# EAGLE design ISE2024_14thboard#1.1 (EAGLE 9.6.2)
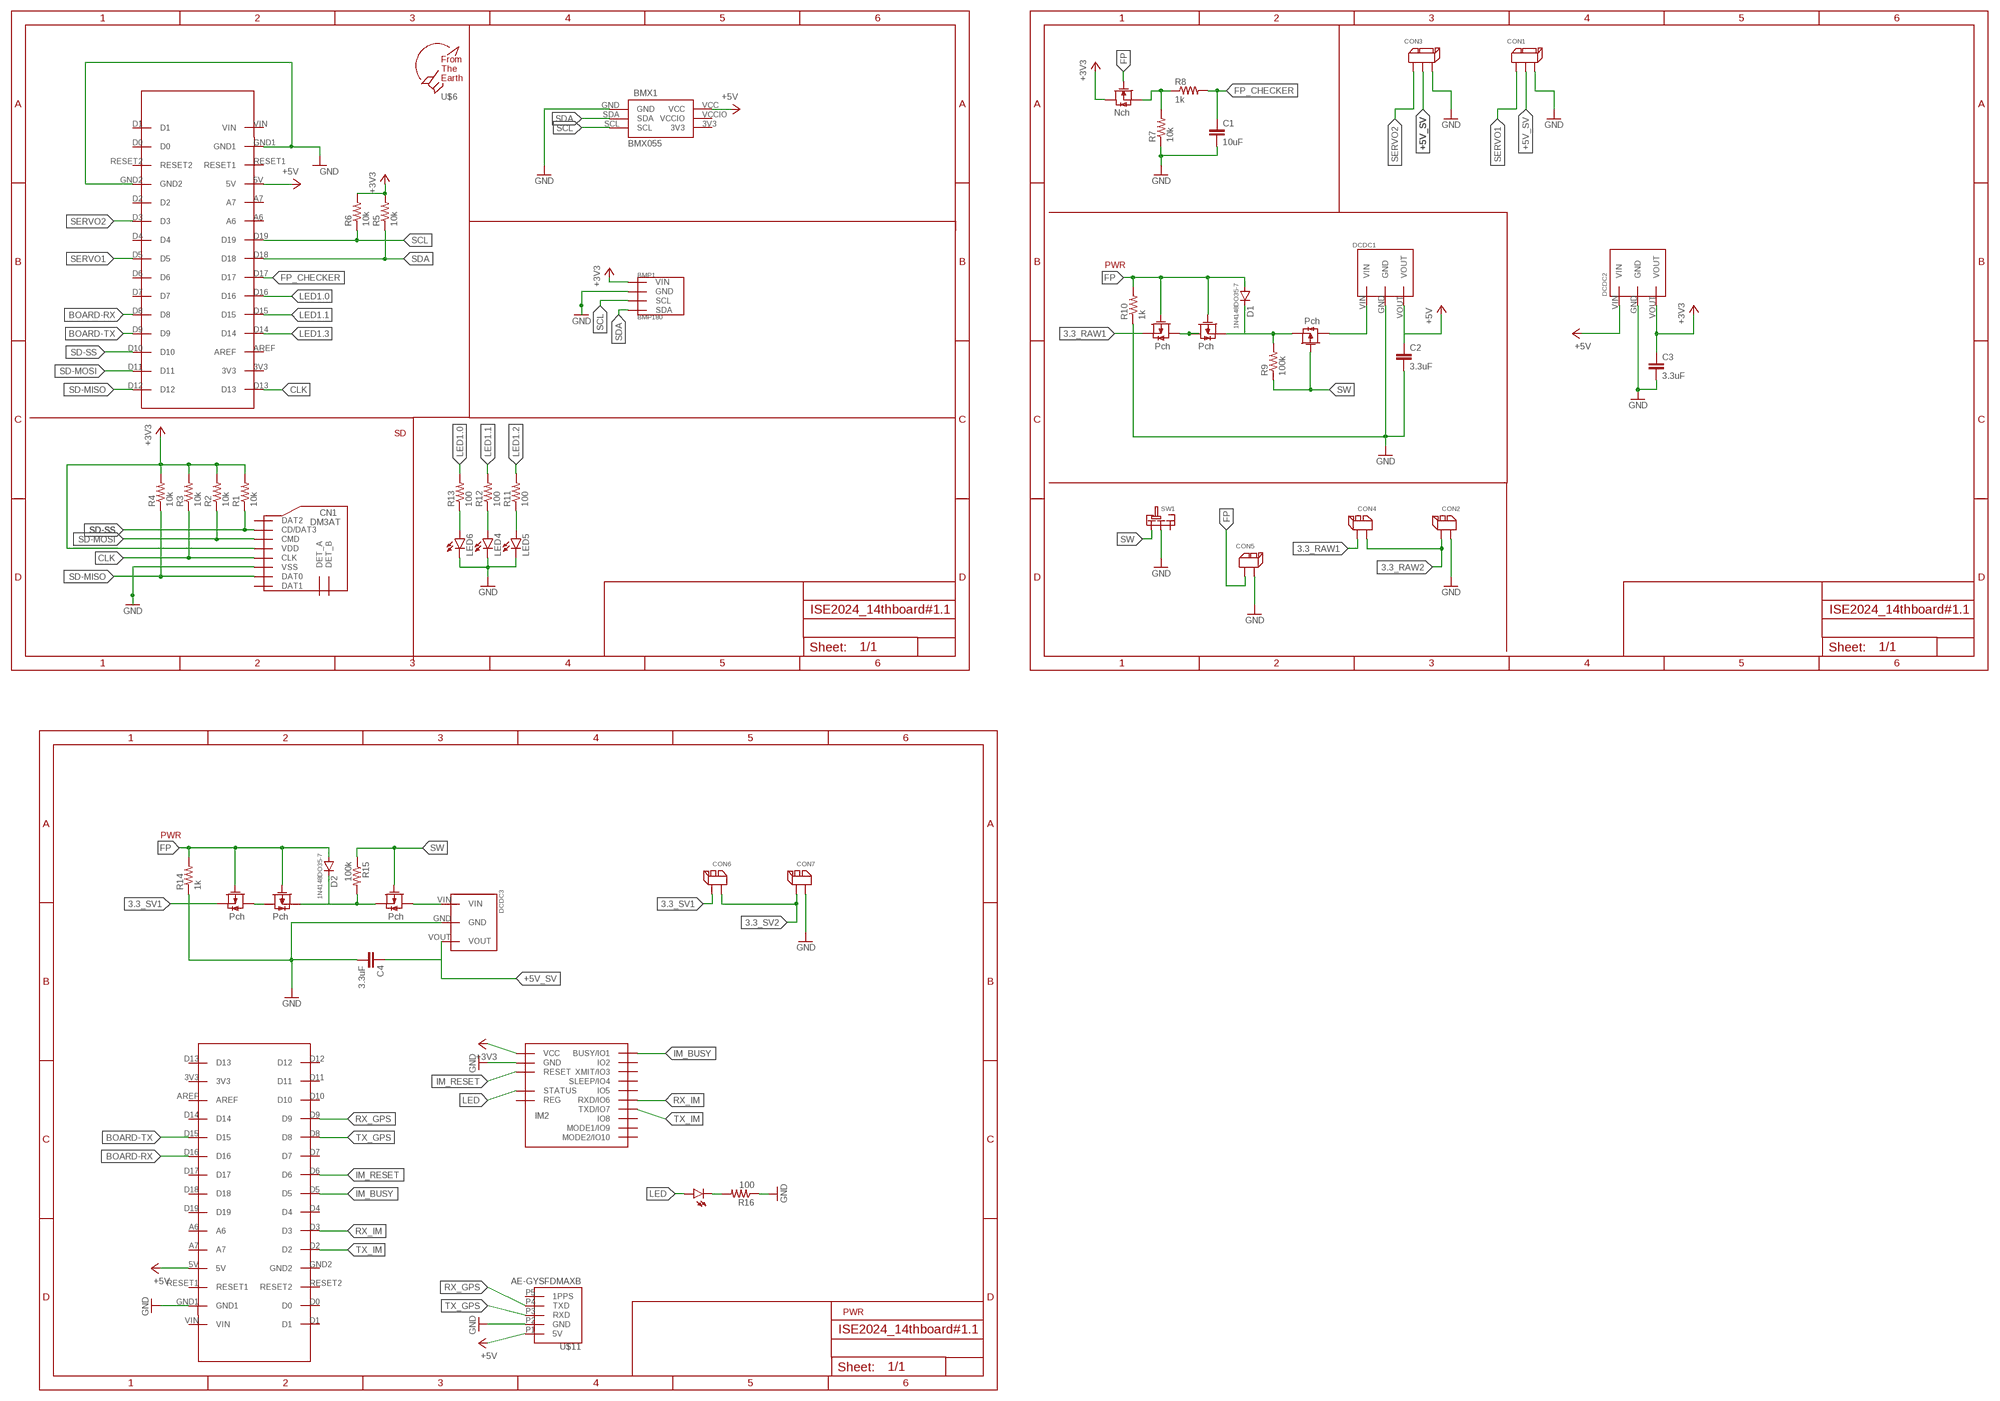
[diagram p0: schematic, sheet 1]

## Parts
BMP1  BMP180  [GY-68]
BMX1  BMX055  [BMX055]
C1  10uF  C-EU025-024X044  [C025-024X044]
C2  3.3uF  C-EU025-024X044  [C025-024X044]
C3  3.3uF  C-EU025-024X044  [C025-024X044]
C4  3.3uF  C-EU025-024X044  [C025-024X044]
CN1  DM3AT  [DM3AT]
CON1  3PIN  [3PIN]
CON2  2PIN  [2PIN]
CON3  3PIN  [3PIN]
CON4  2PIN  [2PIN]
CON5  2PIN  [2PIN]
CON6  2PIN  [2PIN]
CON7  2PIN  [2PIN]
D1  1N4148DO35-7  [DO35-7]
D2  1N4148DO35-7  [DO35-7]
DCDC1  5V1A_M78AR05-1  [5V1A_M78AR05-1]
DCDC2  3.3V1A_M78AR033-1  [3.3V1A_M78AR033-1]
DCDC3  5V1A_M78AR05-1  [5V1A_M78AR05-1]
IM2  IM920_IM920C  [IM920_IM920C]
LED1  LED5MM  [LED5MM]
LED4  LED5MM  [LED5MM]
LED5  LED5MM  [LED5MM]
LED6  LED5MM  [LED5MM]
R1  10k  R-US_0204/7  [0204/7]
R2  10k  R-US_0204/7  [0204/7]
R3  10k  R-US_0204/7  [0204/7]
R4  10k  R-US_0204/7  [0204/7]
R5  10k  R-US_0204/7  [0204/7]
R6  10k  R-US_0204/7  [0204/7]
R7  10k  R-US_0204/7  [0204/7]
R8  1k  R-US_0204/7  [0204/7]
R9  100k  R-US_0204/7  [0204/7]
R10  1k  R-US_0204/7  [0204/7]
R11  100  R-US_0204/7  [0204/7]
R12  100  R-US_0204/7  [0204/7]
R13  100  R-US_0204/7  [0204/7]
R14  1k  R-US_0204/7  [0204/7]
R15  100k  R-US_0204/7  [0204/7]
R16  100  R-US_0204/7  [0204/7]
SW1  SRIDE_SWITCH  [SRIDE_SWITCH]
U$1  ARDUINONANO  [ARDUINONANO]
U$2  2SJ681-PCH  [2SJ681]
U$3  2SK4017-NCH  [2SK4017]
U$4  2SJ681-PCH  [2SJ681]
U$5  2SJ681-PCH  [2SJ681]
U$6  F.T.E.LOGO  [LOGO]
U$7  ARDUINONANO  [ARDUINONANO]
U$8  2SJ681-PCH  [2SJ681]
U$9  2SJ681-PCH  [2SJ681]
U$10  2SJ681-PCH  [2SJ681]
U$11  AE-GYSFDMAXB  [AE-GYSFDMAXB]

## Nets
3.3_RAW1: CON4.P$2 U$2.SOURCE
3.3_RAW2: CON2.P$2 CON4.P$1
3.3_SV1: CON6.P$2 U$8.SOURCE
3.3_SV2: CON6.P$1 CON7.P$2
+3V3: BMP1.P1(VIN) C3.1 CN1.VDD DCDC2.VOUT IM2.$P17(VCC) R1.2 R2.2 R3.2 R4.2 R5.2 R6.2 U$3.DRAIN
+5V: BMX1.VCC C2.1 DCDC1.VOUT DCDC2.VIN U$1.5V U$7.5V
+5V1: DCDC1.VIN U$5.DRAIN
+5V2: DCDC3.VIN U$9.DRAIN
+5V_SV: C4.1 CON1.P$2 CON3.P$2 DCDC3.VOUT
BOARD-RX: U$1.D8 U$7.D16
BOARD-TX: U$1.D9 U$7.D15
CLK: CN1.CLK R3.1 U$1.D13
FP: CON5.P$1 D1.A D2.A R10.2 R14.2 U$2.GATE U$3.GATE U$4.GATE U$8.GATE U$10.GATE
FP_CHECKER: C1.1 R8.2 U$1.D17
GND: BMP1.P2(GND) BMX1.GND C1.2 C2.2 C3.2 C4.2 CN1.VSS CON1.P$3 CON2.P$1 CON3.P$3 CON5.P$2 CON7.P$1 DCDC1.GND DCDC2.GND DCDC3.GND IM2.$P18(GND) LED4.K(C) LED5.K(C) LED6.K(C) R7.1 R10.1 R14.1 R16.1 SW1.LR U$1.GND1 U$1.GND2 U$7.GND1 U$11.P2(GND)
IM_BUSY: IM2.$P1(BUSY/IO1) U$7.D5
IM_RESET: IM2.$P19(RESET) U$7.D6
LED: IM2.$P15(STATUS) LED1.A
LED1.0: R13.2 U$1.D16
LED1.1: R12.2 U$1.D15
LED1.2: R11.2
LED1.3: U$1.D14
N$1: U$2.DRAIN U$4.DRAIN
N$2: LED6.A R13.1
N$3: D1.C R9.2 U$4.SOURCE U$5.SOURCE
N$4: D2.C R15.2 U$9.SOURCE U$10.SOURCE
N$5: U$8.DRAIN U$10.DRAIN
N$6: U$11.P1(5V) ; supply symbol labelled +5V
N$7: LED4.A R12.1
N$8: LED1.K(C) R16.2
N$9: LED5.A R11.1
N$14: R7.2 R8.1 U$3.SOURCE
RX_GPS: U$7.D9 U$11.P4(TXD)
RX_IM: IM2.$P6(RXD/IO6) U$7.D3
SCL: BMP1.P3(SCL) BMX1.SCL R6.1 U$1.D19
SD-MISO: CN1.DAT0 R4.1 U$1.D12
SD-MOSI: CN1.CMD R2.1 U$1.D11
SD-SS: CN1.CD/DAT3 R1.1 U$1.D10
SDA: BMP1.P4(SDA) BMX1.SDA R5.1 U$1.D18
SERVO1: CON1.P$1 U$1.D5
SERVO2: CON3.P$1 U$1.D3
SW: R9.1 R15.1 SW1.L U$5.GATE U$9.GATE
TX_GPS: U$7.D8 U$11.P3(RXD)
TX_IM: IM2.$P7(TXD/IO7) U$7.D2
Unconnected: CN1.DAT1 CN1.DAT2 CN1.DET_A CN1.DET_B IM2.$P2(IO2) IM2.$P3(XMIT/IO3) IM2.$P4(SLEEP/IO4) IM2.$P5(IO5) IM2.$P8(IO8) IM2.$P9(MODE1/IO9) IM2.$P10(MODE2/IO10) IM2.$P16(REG) SW1.R U$1.3V3 U$1.A6 U$1.A7 U$1.AREF U$1.D0 U$1.D1 U$1.D2 U$1.D4 U$1.D6 U$1.D7 U$1.RESET1 U$1.RESET2 U$1.VIN U$7.3V3 U$7.A6 U$7.A7 U$7.AREF U$7.D0 U$7.D1 U$7.D4 U$7.D7 U$7.D10 U$7.D11 U$7.D12 U$7.D13 U$7.D14 U$7.D17 U$7.D18 U$7.D19 U$7.GND2 U$7.RESET1 U$7.RESET2 U$7.VIN U$11.P5(1PPS)

## Notes on the sheet
- PWR
- SD
- PWR
- PWR

## Power pins joined to a net without a drawn wire
3V3: BMX1.3V3
VCCIO: BMX1.VCCIO

## Library data of the parts
BMP1 = BMP180:BMP180
BMX1 = BMX055:BMX055
C1-C4 = rcl:C-EU: CAPACITOR, European symbol; SPICEPREFIX: C
CN1 = microSD:DM3AT
CON1 CON3 = XR Connector:3PIN
CON2 CON4-CON7 = XR Connector:2PIN
D1 D2 = diode:1N4148: DIODE high speed (Philips)
DCDC1 DCDC3 = DC-DC:5V1A_M78AR05-1
DCDC2 = DC-DC:3.3V1A_M78AR033-1
IM2 = CANSAT12th:IM920_IM920C
LED1 LED4-LED6 = led:LED: LED OSRAM: - CHIPLED LG R971, LG N971, LY N971, LG Q971, LY Q971, LO R971, LY R971 LH N974, LH R974 LS Q976, LO Q976, LY Q976 LO Q996 - Hyper CHIPLED LW Q18S LB Q993, LB Q99A, LB R99A - SideLED LS A670, LO A670, LY A670, LG A670, LP A670 LB A673, LV A673, LT A673, LW A673 LH A674 LY A675 LS A676, LA A676, LO A676, LY A676, LW A676 LS A679, LY A679, LG A679 - Hyper Micro SIDELED® LS Y876, LA Y876, LO Y876, LY Y876 LT Y87S - SmartLED LW L88C, LW L88S LB L89C, LB L89S, LG L890 LS L89K, LO L89K, LY L89K LS L896, LA L896, LO L896, LY L896 - TOPLED LS T670, LO T670, LY T670, LG T670, LP T670 LSG T670, LSP T670, LSY T670, LOP T670, LYG T670 LG T671, LOG T671, LSG T671 LB T673, LV T673, LT T673, LW T673 LH T674 LS T676, LA T676, LO T676, LY T676, LB T676, LH T676, LSB T676, LW T676 LB T67C, LV T67C, LT T67C, LS T67K, LO T67K, LY T67K, LW E67C LS E67B, LA E67B, LO E67B, LY E67B, LB E67C, LV E67C, LT E67C LW T67C LS T679, LY T679, LG T679 LS T770, LO T770, LY T770, LG T770, LP T770 LB T773, LV T773, LT T773, LW T773 LH T774 LS E675, LA E675, LY E675, LS T675 LS T776, LA T776, LO T776, LY T776, LB T776 LHGB T686 LT T68C, LB T68C - Hyper Mini TOPLED® LB M676 - Mini TOPLED Santana® LG M470 LS M47K, LO M47K, LY M47K Source: http://www.osram.convergy.de LUXEON: - LUMILED® LXK2-PW12-R00, LXK2-PW12-S00, LXK2-PW14-U00, LXK2-PW14-V00 LXK2-PM12-R00, LXK2-PM12-S00, LXK2-PM14-U00 LXK2-PE12-Q00, LXK2-PE12-R00, LXK2-PE12-S00, LXK2-PE14-T00, LXK2-PE14-U00 LXK2-PB12-K00, LXK2-PB12-L00, LXK2-PB12-M00, LXK2-PB14-N00, LXK2-PB14-P00, LXK2-PB14-Q00 LXK2-PR12-L00, LXK2-PR12-M00, LXK2-PR14-Q00, LXK2-PR14-R00 LXK2-PD12-Q00, LXK2-PD12-R00, LXK2-PD12-S00 LXK2-PH12-R00, LXK2-PH12-S00 LXK2-PL12-P00, LXK2-PL12-Q00, LXK2-PL12-R00 Source: www.luxeon.com KINGBRIGHT: KA-3528ASYC Source: www.kingbright.com
R1-R16 = rcl:R-US_: RESISTOR, American symbol; SPICEPREFIX: R
SW1 = Sride Switch:SRIDE_SWITCH
U$1 U$7 = arduinonano device:ARDUINONANO
U$2 U$4 U$5 U$8-U$10 = mosfet:2SJ681-PCH
U$3 = mosfet:2SK4017-NCH
U$6 = logo:F.T.E.LOGO
U$11 = AE-GYSFDMAXB:AE-GYSFDMAXB

## Net classes
0 default: width 0.406 mm

## Board
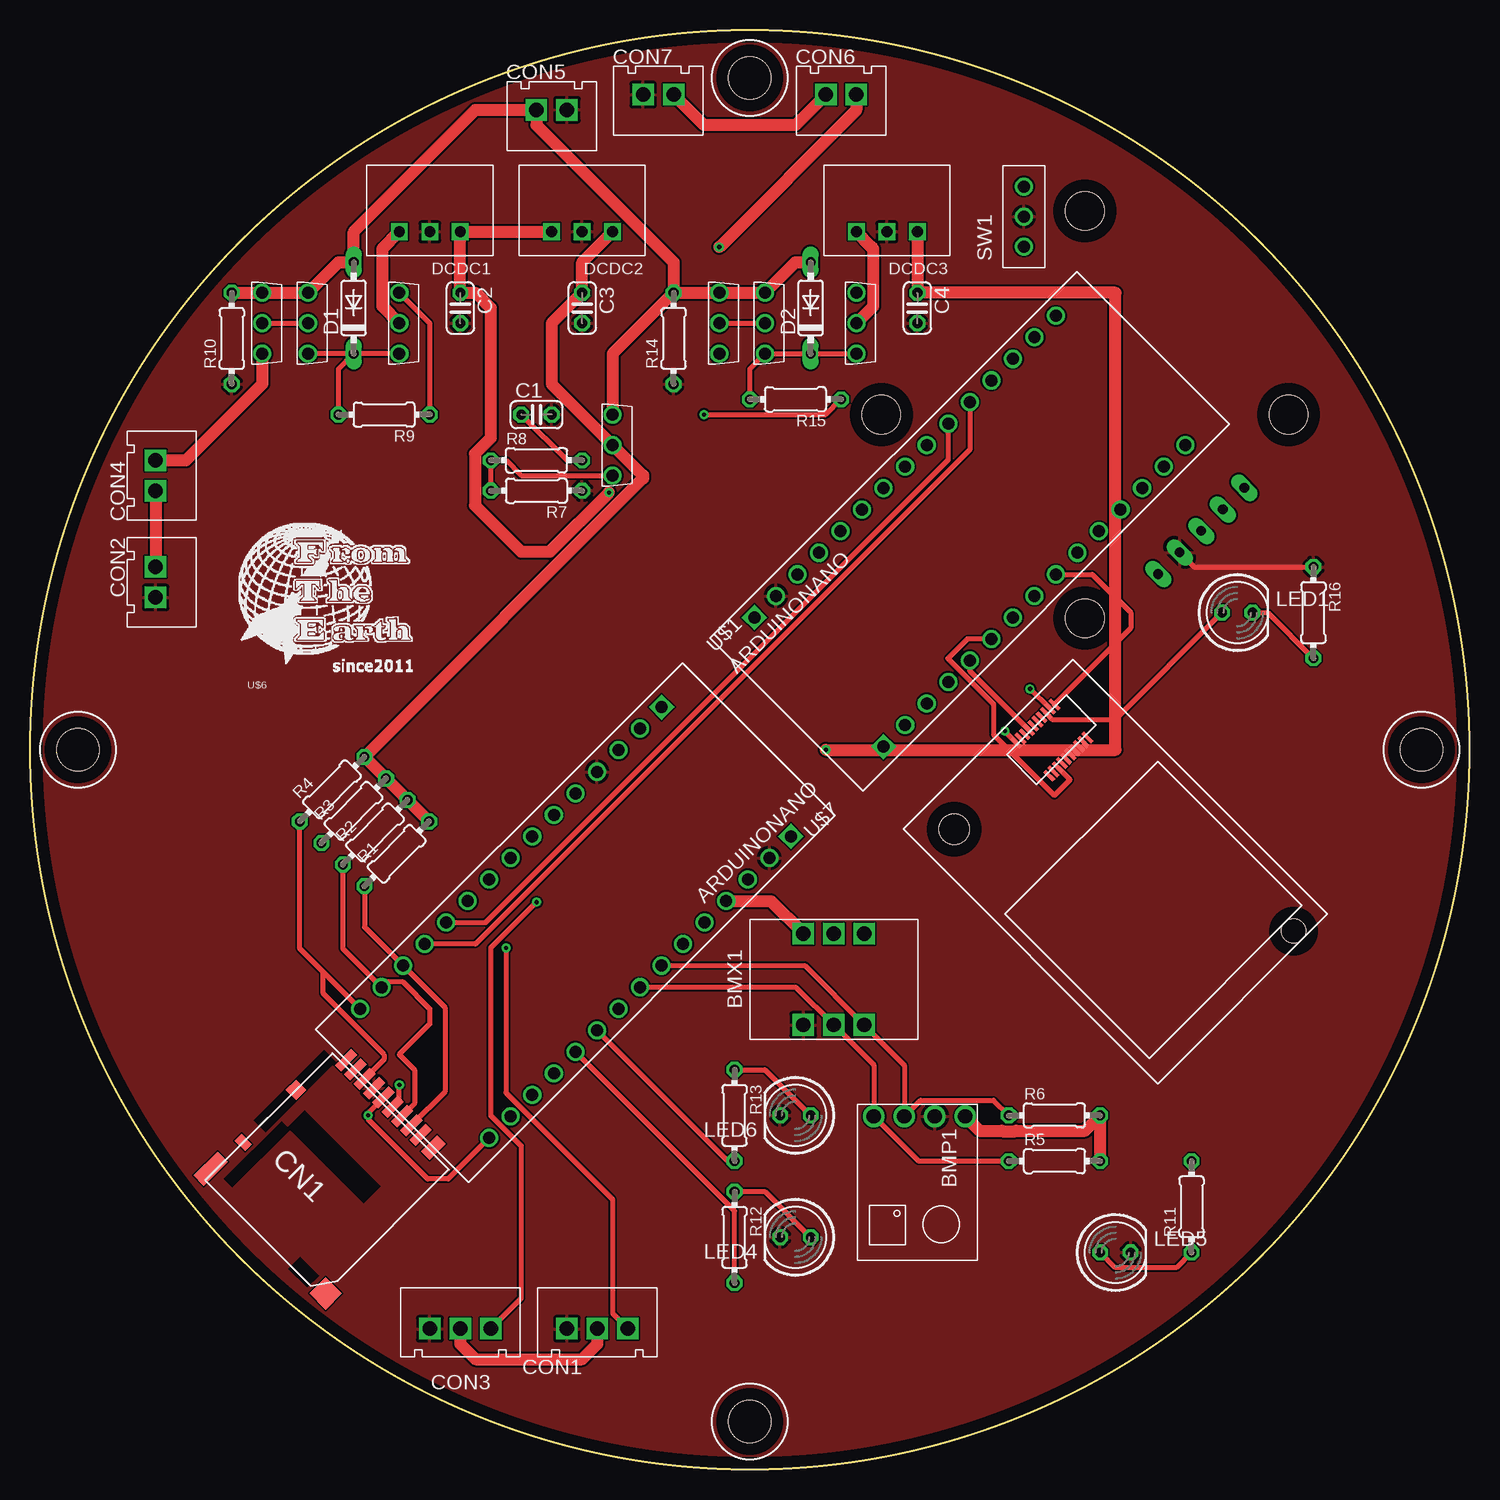
[diagram p1: board, top side]
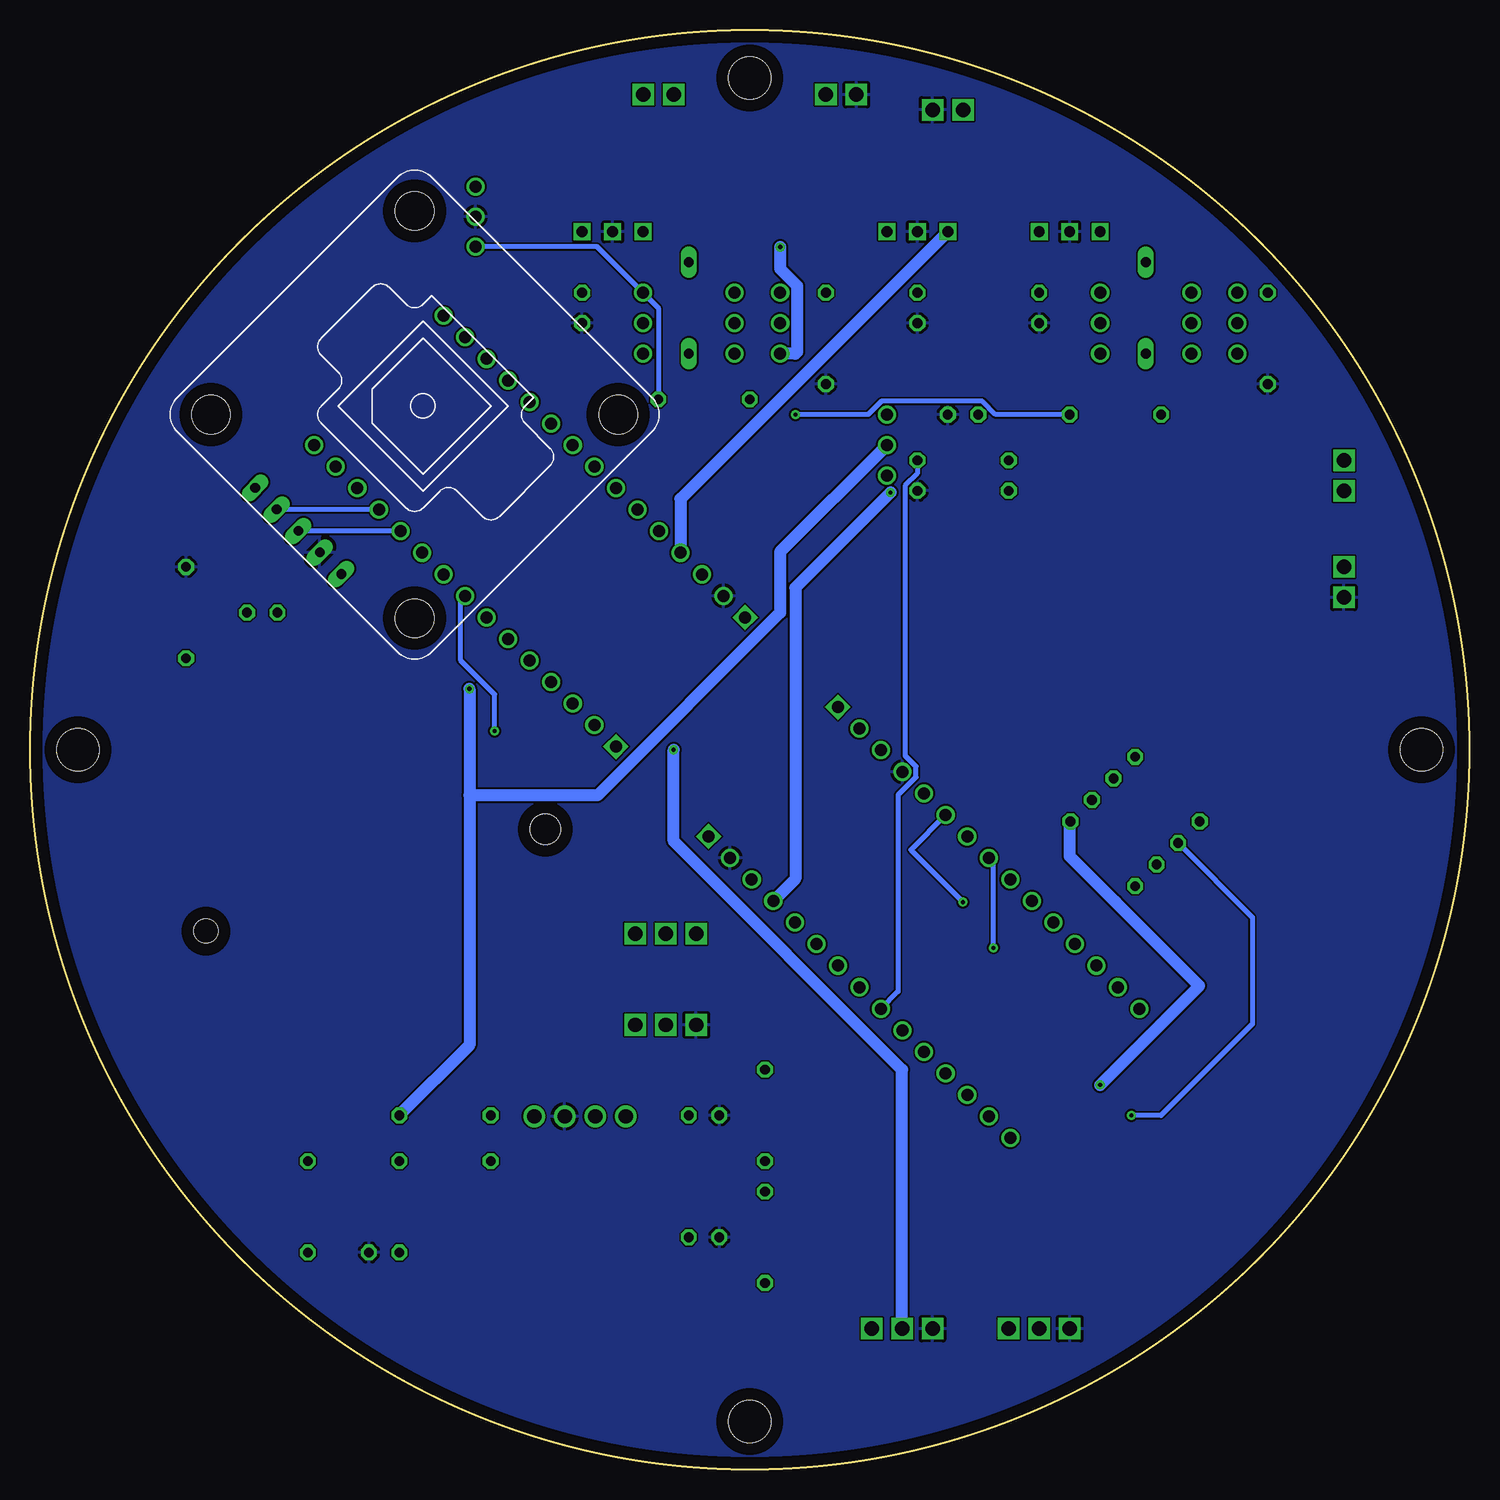
[diagram p2: board, bottom side, seen from below]

Size 120 x 120 mm. Coordinates in mm from the lower left corner, seen from the top.
Outline: circle at 60,60 radius 60
Copper layers (1*16): Top 0.035mm / dielectric 1.5mm / Bottom 0.035mm
Design rules "default": minimum track width 6mil, minimum drill 0.35mm, track to track 6mil, track to pad 6mil, pad to pad 6mil, via to via 6mil, smd to smd 6mil, copper to edge 40mil, drill to drill 6mil, minimum pad ring 10mil, minimum via ring 8mil, stop-mask expansion 4mil, vias tented up to drill 0mil, thermal gap 10mil
Holes 3.5 mm at 60,116 4,60 116,60 60,4

### Footprints (pad centres in the part's own frame; a part is rotated, then mirrored left to right if it is on the bottom)
GY-68 = drill 1.2: P1 -5,4; P2 -5,1.46; P3 -5,-1.08; P4 -5,-3.62
BMX055 = drill 1.2 pad 1.5 square: 3V3 8.81,-9.53; GND 1.19,-4.46; SCL 1.19,-9.53; SDA 1.19,-7; VCC 8.81,-4.46; VCCIO 8.81,-7
C025-024X044 = drill 0.813 octagon: 1 -1.27,0; 2 1.27,0
DM3AT = smd 0.7 x 1.9: CD/DAT3 2.2,6.4; CLK -1.1,6.4; CMD 1.1,6.4; DAT0 -3.3,6.4; DAT1 -4.4,6.4; DAT2 3.3,6.4; DET_B -5.5,6.4; VDD 0,6.4; VSS -2.2,6.4 | smd 1.2 x 0.8: DET_A -6.7,-4.5 | smd 1 x 1.9: P$9 4.8,6.381 | smd 1.2 x 1.2: P$11 -6.7,1.7 | smd 1.2 x 2.8: P$13 -7.081,-7.973 | smd 1.9 x 1.9: P$14 7.054,-8.562
3PIN = drill 1.2 square: P$1 2.54,-2.54; P$2 5.08,-2.54; P$3 7.62,-2.54
2PIN = drill 1.2 square: P$1 -1.27,0; P$2 1.27,0
DO35-7 = drill 0.813 long: A 3.81,0; C -3.81,0
5V1A_M78AR05-1 = drill 0.9 pad 1.27 square: GND 0,0; VIN 2.54,0; VOUT -2.54,0
3.3V1A_M78AR033-1 = drill 0.9 pad 1.27 square: GND 0,0; VIN 2.54,0; VOUT -2.54,0
IM920_IM920C = smd 0.3 x 1.1: $P1 -1.75,-13.45; $P2 -1.75,-9.55; $P3 -2.25,-13.45; $P4 -2.25,-9.55; $P5 -2.75,-13.45; $P6 -2.75,-9.55; $P7 -3.25,-13.45; $P8 -3.25,-9.55; $P9 -3.75,-13.45; $P10 -3.75,-9.55; $P11 -4.25,-13.45; $P12 -4.25,-9.55; $P13 -4.75,-13.45; $P14 -4.75,-9.55; $P15 -5.25,-13.45; $P16 -5.25,-9.55; $P17 -5.75,-13.45; $P18 -5.75,-9.55; $P19 -6.25,-13.45; $P20 -6.25,-9.55 | hole 2.5: 7,-12 | hole 2: -7,14
LED5MM = drill 0.813 octagon: A -1.27,0; K 1.27,0
0204/7 = drill 0.813 octagon: 1 -3.81,0; 2 3.81,0
SRIDE_SWITCH = drill 1: L -2.5,0; LR 0,0; R 2.5,0
ARDUINONANO = drill 1: 3V3 3.81,-16.51; 5V 29.21,-16.51; A6 24.13,-16.51; A7 26.67,-16.51; AREF 6.35,-16.51; D0 34.29,-1.27; D2 26.67,-1.27; D3 24.13,-1.27; D4 21.59,-1.27; D5 19.05,-1.27; D6 16.51,-1.27; D7 13.97,-1.27; D8 11.43,-1.27; D9 8.89,-1.27; D10 6.35,-1.27; D11 3.81,-1.27; D12 1.27,-1.27; D13 1.27,-16.51; D14 8.89,-16.51; D15 11.43,-16.51; D16 13.97,-16.51; D17 16.51,-16.51; D18 19.05,-16.51; D19 21.59,-16.51; GND1 34.29,-16.51; GND2 29.21,-1.27; RESET1 31.75,-16.51; RESET2 31.75,-1.27 | drill 1 square: D1 36.83,-1.27; VIN 36.83,-16.51
2SJ681 = drill 1: DRAIN 0,0; GATE 2.54,0; SOURCE -2.54,0
2SK4017 = drill 1: DRAIN 0,0; GATE 2.54,0; SOURCE -2.54,0
AE-GYSFDMAXB = drill 0.8 long: P1 13.716,5.08; P2 13.716,2.54; P3 13.716,0; P4 13.716,-2.54; P5 13.716,-5.08 | hole 3.2: -12,12; 12,12; 12,-12; -12,-12

### Placement (x,y rotation side)
BMP1  73.97,24.44 270 top
BMX1  60,35.87 90 top
C1  42.22,87.94 0 top
C2  35.87,96.83 270 top
C3  46.03,96.83 270 top
C4  73.97,96.83 270 top
CN1  25.71,25.71 315 top
CON1  52.38,9.2 180 top
CON2  10.47,73.97 90 top
CON3  40.95,9.2 180 top
CON4  10.47,82.86 90 top
CON5  43.49,113.34 0 top
CON6  67.62,114.61 0 top
CON7  52.38,114.61 0 top
D1  26.98,96.83 90 top
D2  65.08,96.83 90 top
DCDC1  33.33,103.18 180 top
DCDC2  46.03,103.18 180 top
DCDC3  71.43,103.18 180 top
IM2  90.48,49.84 225 top
LED1  100.64,71.43 0 top
LED4  63.81,19.36 180 top
LED5  90.48,18.09 0 top
LED6  63.81,29.52 180 top
R1  30.57,51.33 45 top
R2  28.78,53.12 45 top
R3  26.98,54.92 45 top
R4  25.18,56.72 45 top
R5  85.4,25.71 0 top
R6  85.4,29.52 0 top
R7  42.22,81.59 180 top
R8  42.22,84.13 0 top
R9  29.52,87.94 180 top
R10  16.82,94.29 90 top
R11  96.83,21.9 90 top
R12  58.73,19.36 270 top
R13  58.73,29.52 270 top
R14  53.65,94.29 90 top
R15  63.81,89.21 180 top
R16  106.99,71.43 270 top
SW1  82.86,104.45 90 top
U$1  25.71,38.41 45 top
U$2  19.36,95.56 90 top
U$3  48.57,85.4 90 top
U$4  23.17,95.56 90 top
U$5  30.79,95.56 90 top
U$6  16.82,65.08 0 top
U$7  98.1,85.4 225 top
U$8  57.46,95.56 90 top
U$9  68.89,95.56 90 top
U$10  61.27,95.56 90 top
U$11  87.94,87.94 225 bottom

### Tracks (layer width: path | path; a pad name or v marks a point on that pad's centre or on a via)
3.3_RAW1
  Top 1.016: CON4.P$2 13.01,84.13 19.36,90.48 U$2.SOURCE
3.3_RAW2
  Top 1.016: CON4.P$1 CON2.P$2
3.3_SV1  (via drill 0.35)
  Top 1.016: CON6.P$2 68.89,113.34 v57.46,101.91
  Bottom 1.016: v57.46,101.91 57.46,100.1 56.05,98.69 56.05,93.16 56.19,93.02 U$8.SOURCE
3.3_SV2
  Top 1.016: CON7.P$2 56.19,112.07 63.81,112.07 CON6.P$1
+3V3  (via drill 0.35)
  Top 0.406: 87.94,28.25 79.16,28.25 | 85.02,63.43 v83.37,65.08 | CN1.VDD 30.79,30.79 v30.79,32.06 | IM2.$P17 85.02,63.43 | 85.02,63.43
  Top 1.016: R4.2 R3.2 | R3.2 | R3.2 | R3.2 R2.2 R1.2 | BMP1.P1 79.16,28.25 80.99,28.25 81.04,28.2 82.14,28.2 82.19,28.25 87.94,28.25 R6.2 R5.2 | DCDC2.VOUT 46.03,100.64 C3.1 43.49,95.56 43.49,90.48 U$3.DRAIN 51.11,82.86 51.11,82.64 R4.2 | R4.2 R3.2
  Bottom 1.016: v83.37,65.08 83.37,56.19 | 83.37,56.19 83.37,35.36 R6.2 | U$3.DRAIN 57.46,76.51 57.46,71.43 72.7,56.19 83.37,56.19 | R1.2 33.33,53.96 33.33,51.11 29.52,47.3 29.51,47.31 22.52,40.33 v30.79,32.06
+5V  (via drill 0.35)
  Top 1.016: U$1.5V 61.75,47.39 BMX1.VCC | DCDC2.VIN DCDC1.VOUT C2.1 37.14,98.1 38.41,96.83 38.41,86 37.09,84.68 37.09,80.37 40.95,76.51 43.33,76.51 v48.26,81.45
  Bottom 1.016: DCDC2.VIN 65.77,80.9 U$7.5V | U$1.5V 56.19,49.24 56.19,73.52 v48.26,81.45
+5V1
  Top 1.016: DCDC1.VIN 29.38,101.77 29.38,96.97 U$5.DRAIN
+5V2
  Top 1.016: U$9.DRAIN 70.16,96.83 70.3,96.97 70.3,101.77 70.16,101.91 DCDC3.VIN
+5V_SV  (via drill 0.35)
  Top 1.016: DCDC3.VOUT C4.1 90.48,98.1 90.48,60 v66.35,60 | CON3.P$2 35.87,10.47 37.14,9.2 46.03,9.2 47.3,10.47 CON1.P$2
  Bottom 1.016: CON1.P$2 47.3,33.33 66.35,52.38 v66.35,60
BOARD-RX
  Top 0.406: U$1.D8 37.97,45.59 76.55,84.17 U$7.D16
BOARD-TX
  Top 0.406: U$7.D15 78.34,85 37.14,43.8 U$1.D9
CLK  (via drill 0.35)
  Top 0.406: CN1.CLK 28.19,29.74 v28.19,29.52 28.19,29.18 33.16,24.21 34.86,24.21 U$1.D13
  Bottom 0.406: R3.1 18.09,46.03 18.09,37.14 25.71,29.52 v28.19,29.52
FP
  Top 1.016: R10.2 U$2.GATE U$4.GATE 25.71,100.64 D1.A 26.98,103.18 37.14,113.34 CON5.P$1 42.22,112.07 53.65,100.64 R14.2 | R14.2 U$8.GATE U$10.GATE 63.81,100.64 D2.A | R14.2 48.57,93.02 U$3.GATE
FP_CHECKER
  Top 0.406: C1.1 44.76,84.13 R8.2
  Bottom 0.406: R8.2 46.03,83.03 47.05,82.01 47.05,59.52 46.14,58.62 46.14,57.72 47.63,56.23 47.63,39.84 U$1.D17
GND
  Top 0.406: U$11.P2 97.05,75.24 R16.1
  pour Top: -220.67,167.95 -220.67,180.65 -174.95,226.37 71.43,226.37 209.86,87.94 106.99,-14.93 -181.3,-14.93 -220.67,24.44
  pour Bottom: -227.02,152.71 -227.02,165.41 -162.25,230.18 120.96,230.18 192.08,159.06 192.08,40.95 132.39,-18.74 126.04,-25.09 -127.96,-25.09 -227.02,73.97
IM_BUSY  (via drill 0.35)
  Top 0.406: IM2.$P1 81.26,61.53 v81.26,61.56
  Bottom 0.406: U$7.D5 84.13,72.43 84.13,67.48 81.26,64.62 v81.26,61.56
IM_RESET
  Top 0.406: U$7.D6 88.56,74.62 91.75,71.43 91.75,70.13 IM2.$P19
LED
  Top 0.406: LED1.A 90.48,62.54 85.2,62.54 IM2.$P15 | IM2.$P15
LED1.0
  Top 0.406: R13.2 58.17,25.71 U$1.D16
LED1.1
  Top 0.406: R12.2 58.73,21.55 U$1.D15
N$1
  Top 0.406: U$2.DRAIN U$4.DRAIN
N$2
  Top 0.406: R13.1 61.27,33.33 LED6.A
N$3
  Top 0.406: R9.2 25.71,91.75 D1.C | U$5.SOURCE D1.C | D1.C U$4.SOURCE
N$4
  Top 0.406: R15.2 60,91.75 U$10.SOURCE D2.C U$9.SOURCE
N$5
  Top 0.406: U$8.DRAIN U$10.DRAIN
N$7
  Top 0.406: R12.1 61.27,23.17 LED4.A
N$8
  Top 0.406: LED1.K 103.18,71.43 R16.2
N$9
  Top 0.406: R11.1 95.56,16.82 90.48,16.82 LED5.A
N$14
  Top 0.406: R7.2 R8.1 39.68,84.13 40.95,82.86 U$3.SOURCE
RX_GPS
  Bottom 0.406: U$7.D9 99.41,80.01 U$11.P4
RX_IM
  Top 0.406: U$7.D3 78.13,69.24 76.51,67.62 77.78,66.34 80.32,63.81 80.32,61.27 85.4,56.19 86.67,57.46 86.67,57.54 IM2.$P6
SCL
  Top 0.406: U$1.D19 61.27,42 61.49,42 64.59,42 BMX1.SCL 72.89,33.7 BMP1.P3 74.24,30.79 80.32,30.79 R6.1
SD-MISO
  Top 0.406: CN1.DAT0 29.52,34.19 29.52,34.6 24.44,39.68 24.44,41.48 | U$1.D12 24.7,41.21 24.44,41.48 | 24.44,41.48 22.49,43.43 R4.1
SD-MOSI
  Top 0.406: CN1.CMD 32.06,30.5 32.06,33.33 30.79,34.6 33.33,37.14 33.33,38.41 31.05,40.69 29.78,40.69 U$1.D11 26.08,43.43 R2.1
SD-SS
  Top 0.406: CN1.CD/DAT3 34.6,31.49 34.6,38.5 U$1.D10 27.88,45.22 R1.1
SDA
  Top 0.406: R5.1 74.08,25.71 BMP1.P4 70.35,33.71 BMX1.SDA 63.85,40.21 U$1.D18
SERVO1  (via drill 0.35)
  Top 0.406: CON1.P$1 48.57,13.01 48.57,22.51 39.68,31.4 v39.68,43.49
  Bottom 0.406: v39.68,43.49 39.68,50.58 U$1.D5
SERVO2  (via drill 0.35)
  Top 0.406: v42.22,47.3 38.41,43.49 38.41,29.52 40.95,26.98 40.95,14.28 CON3.P$1
  Bottom 0.406: U$1.D3 46.58,51.66 v42.22,47.3
SW  (via drill 0.35)
  Top 0.406: U$5.GATE 33.33,95.56 R9.1 | v56.19,87.94 66.35,87.94 R15.1
  Bottom 0.406: SW1.L 72.74,101.95 U$9.GATE 67.62,96.83 R15.1 | R9.1 39.51,87.94 40.62,89.05 49.03,89.05 50.14,87.94 v56.19,87.94
TX_GPS
  Bottom 0.406: U$7.D8 97.61,78.22 U$11.P3
TX_IM
  Top 0.406: U$7.D2 78.34,66.57 82.38,62.54 | 82.38,62.54 IM2.$P7 | 82.38,62.54